# EAGLE design レシーバ (EAGLE 9.6.2)
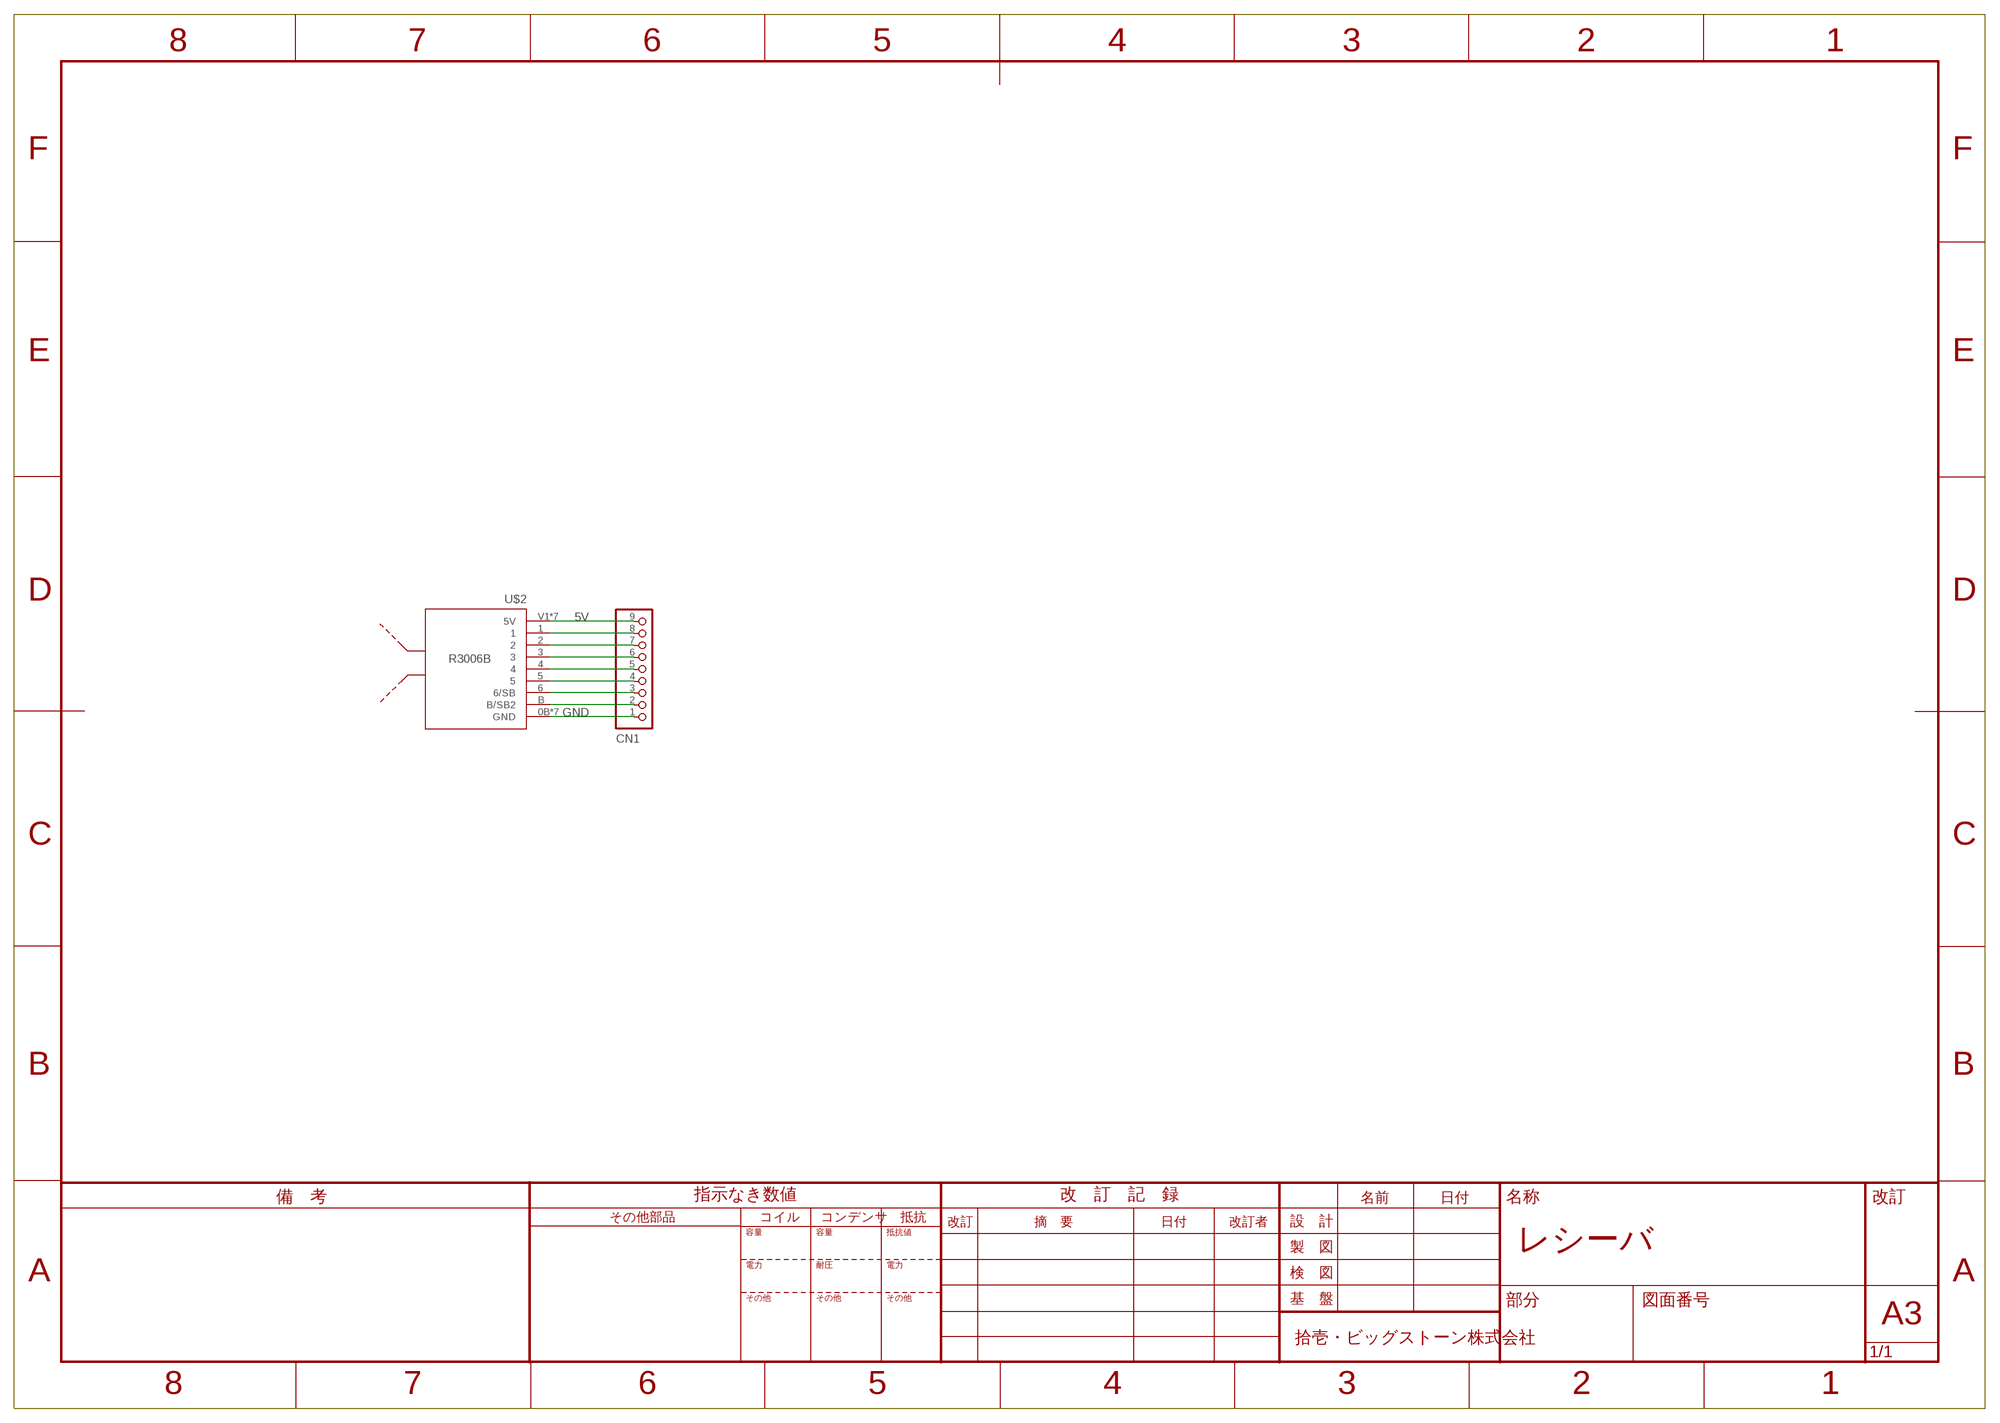
[diagram p0: schematic, sheet 1]

## Parts
CN1  B9B-XH-A  [B9B-XH-A]
U$2  R3006B  [R3006B]

## Nets
5V: CN1.9 U$2.V1(5V) U$2.V2(5V) U$2.V3(5V) U$2.V4(5V) U$2.V5(5V) U$2.V6(5V) U$2.VB(5V)
GND: CN1.1 U$2.0B(GND) U$2.01(GND) U$2.02(GND) U$2.03(GND) U$2.04(GND) U$2.05(GND) U$2.06(GND)
N$2: CN1.8 U$2.1
N$3: CN1.7 U$2.2
N$4: CN1.6 U$2.3
N$5: CN1.5 U$2.4
N$6: CN1.4 U$2.5
N$7: CN1.3 U$2.6(6/SB)
N$8: CN1.2 U$2.B(B/SB2)

## Library data of the parts
CN1 = jst-xh:B9B-XH-A: Wire-to-Board 2.5mm pitch top mount connector Source: http://www.jst-mfg.com/product/pdf/jpn/XH.pdf http://www.jst-mfg.com/product/detail.php?series=277
U$2 = レシーバ:R3006B

## Board
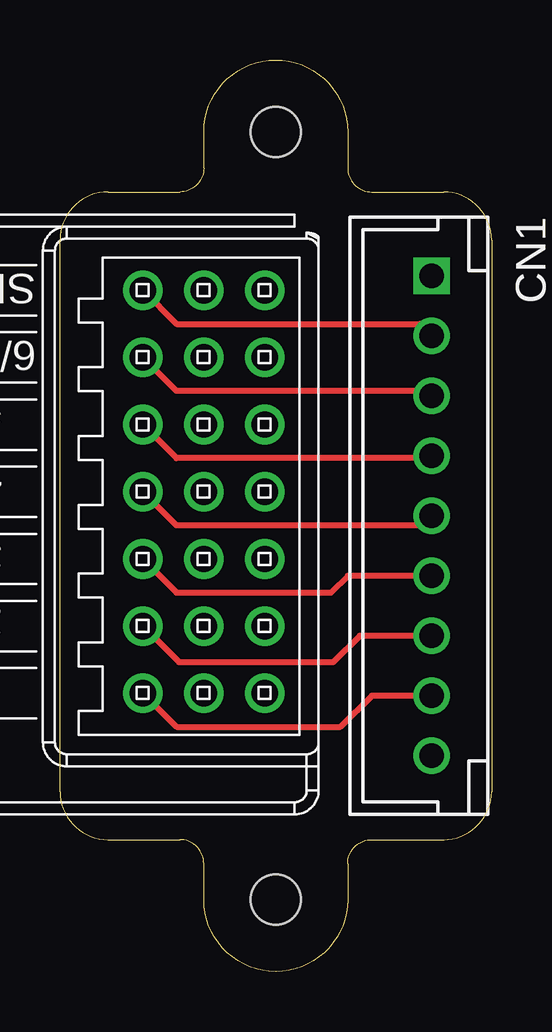
[diagram p1: board, top side]
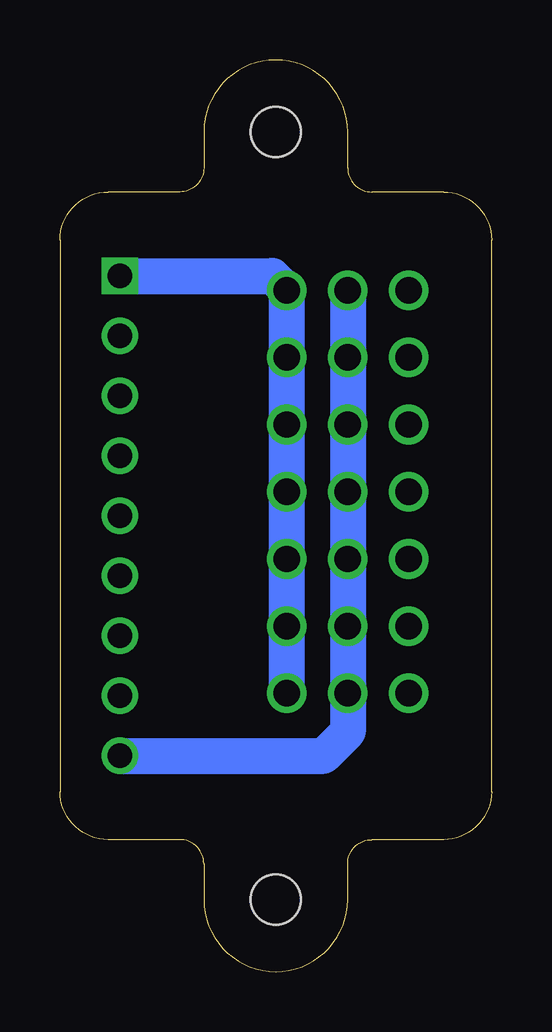
[diagram p2: board, bottom side, seen from below]

Size 18 x 38 mm. Coordinates in mm from the lower left corner, seen from the top.
Outline: 0,7.5 0,30.5 arc-90 2,32.5 5,32.5 arc90 6,33.5 6,35 arc-90 9,38 arc-90 12,35 12,33.5 arc90 13,32.5 16,32.5 arc-90 18,30.5 18,7.5 arc-90 16,5.5 13,5.5 arc90 12,4.5 12,3 arc-90 9,0 arc-90 6,3 6,4.5 arc90 5,5.5 2,5.5 arc-90 0,7.5
Copper layers (1*16): Top 0.035mm / dielectric 1.5mm / Bottom 0.035mm
Design rules "default": minimum track width 6mil, minimum drill 0.35mm, track to track 6mil, track to pad 6mil, pad to pad 6mil, via to via 6mil, smd to smd 6mil, copper to edge 40mil, drill to drill 6mil, minimum pad ring 10mil, minimum via ring 8mil, stop-mask expansion 4mil, vias tented up to drill 0mil, thermal gap 10mil
Holes 2.1 mm at 9,35 9,3

### Footprints (pad centres in the part's own frame; a part is rotated, then mirrored left to right if it is on the bottom)
B9B-XH-A = drill 1.016 square: 1 -10,0 | drill 1.016: 2 -7.5,0; 3 -5,0; 4 -2.5,0; 5 0,0; 6 2.5,0; 7 5,0; 8 7.5,0; 9 10,0
R3006B = drill 1.1: 0B 2.54,8.4; 1 -2.54,-8.4; 01 2.54,-8.4; 2 -2.54,-5.6; 02 2.54,-5.6; 3 -2.54,-2.8; 03 2.54,-2.8; 4 -2.54,0; 04 2.54,0; 5 -2.54,2.8; 05 2.54,2.8; 6 -2.54,5.6; 06 2.54,5.6; B -2.54,8.4; V1 0,-8.4; V2 0,-5.6; V3 0,-2.8; V4 0,0; V5 0,2.8; V6 0,5.6; VB 0,8.4

### Placement (x,y rotation side)
CN1  15.5,19 270 top
U$2  6,20 0 top

### Tracks (layer width: path | path; a pad name or v marks a point on that pad's centre or on a via)
5V
  Bottom 1.5: U$2.VB U$2.V6 U$2.V5 U$2.V4 U$2.V3 U$2.V2 U$2.V1 6,10 7,9 CN1.9
GND
  Bottom 1.5: U$2.01 U$2.02 U$2.03 U$2.04 U$2.05 U$2.06 U$2.0B 9.14,29 CN1.1
N$2
  Top 0.254: U$2.1 4.86,10.2 11.7,10.2 13,11.5 CN1.8
N$3
  Top 0.254: U$2.2 4.96,12.9 11.4,12.9 12.5,14 CN1.7
N$4
  Top 0.254: U$2.3 4.86,15.8 11.3,15.8 12,16.5 CN1.6
N$5
  Top 0.254: U$2.4 4.86,18.6 15.1,18.6 CN1.5
N$6
  Top 0.254: U$2.5 4.86,21.4 15.4,21.4 CN1.4
N$7
  Top 0.254: U$2.6 4.86,24.2 14.8,24.2 15,24 CN1.3
N$8
  Top 0.254: U$2.B 4.86,27 15,27 CN1.2

### Text on the board
_tNames: CN1